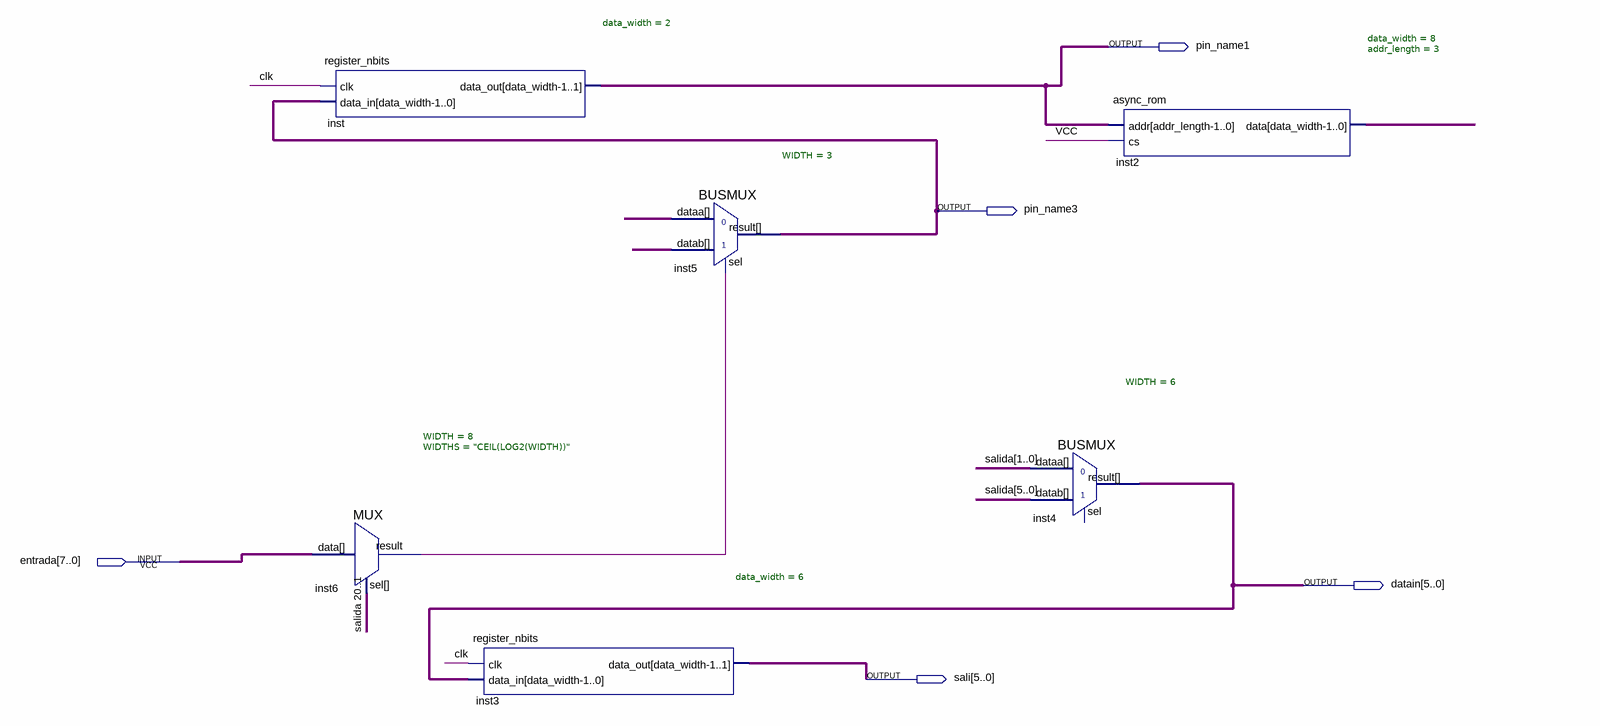
[diagram p0: schematic sheet]
// Quartus schematic P4.bdf as structural Verilog: 6 symbols, 5 pins
module P4 (
  input  [7:0] entrada,
  output pin_name1,
  output pin_name3,
  output [5:0] datain,
  output [5:0] sali
);

  wire clk, inst6_result, \salida_20..1 , VCC;
  wire [2:0] inst5_result, inst_data_out, undriven, undriven_2;
  wire [5:0] salida;
  wire [7:0] inst2_data;

  register_nbits #(.data_width(2)) inst (.clk(clk), .data_in(inst5_result), .data_out(inst_data_out));
  MUX #(.WIDTH(8), .WIDTHS("CEIL(LOG2(WIDTH))")) inst6 (.data(entrada), .sel(\salida_20..1 ), .result(inst6_result));
  register_nbits #(.data_width(6)) inst3 (.clk(clk), .data_in(datain), .data_out(sali));
  BUSMUX #(.WIDTH(3)) inst5 (.datab(undriven), .sel(inst6_result), .dataa(undriven_2), .result(inst5_result));
  BUSMUX #(.WIDTH(6)) inst4 (.datab(salida), .dataa(salida[1:0]), .result(datain));  // open: sel
  async_rom #(.data_width(8), .addr_length(3)) inst2 (.addr(inst_data_out), .cs(VCC), .data(inst2_data));
endmodule
